# Altium schematic sheet io.SchDoc: SD Cards
size A4; Author: Sorgelig; Revision: 1.1; SheetNumber: 3; SheetTotal: 3
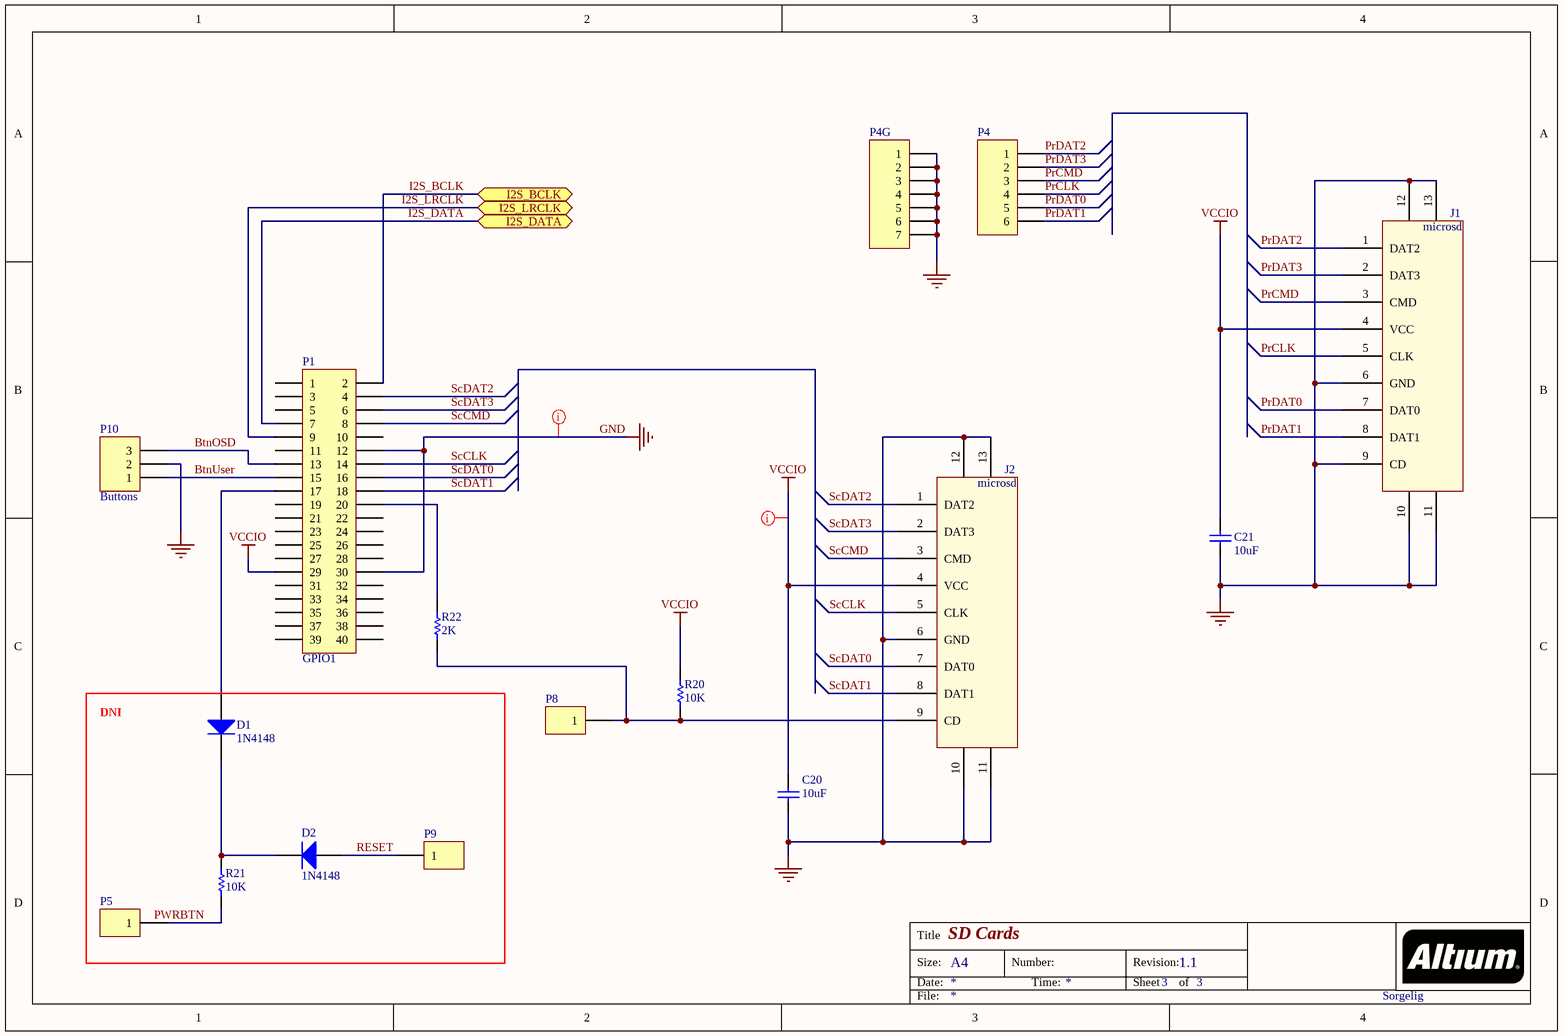
[diagram p0: io.SchDoc]

## Parts
C20  value 10uF  [C0805]  (hidden comment: C0805)
C21  value 10uF  [C0805]  (hidden comment: C0805)
D1  1N4148  [DIODE]
D2  1N4148  [DIODE]
J1  microsd  [microsd]
J2  microsd  [microsd]
P1  GPIO1  [HDR20x2]
P4  Header 6  [HDR1X6]  (value not drawn)
P4G  Header 7  [HDR1X7]  (value not drawn)
P5  Header 1  [Header 1]  (value not drawn)
P8  Header 1  [Header 1]  (value not drawn)
P9  Header 1  [Header 1]  (value not drawn)
P10  Buttons  [HDR1X3]
R20  10K  [R0805]
R21  10K  [R0805]
R22  2K  [R0805]

## Blocks framed on the sheet
DNI: D1 D2 P5 P9 R21

## Ports
I2S_BCLK, I2S_DATA, I2S_LRCLK

## Nets
GND: C20.1 C21.1 J1.6(GND) J1.9(CD) J1.10(GND) J1.11(GND) J1.12(GND) J1.13(GND) J2.6(GND) J2.10(GND) J2.11(GND) J2.12(GND) J2.13(GND) P1.12 P1.30 P4G.1 P4G.2 P4G.3 P4G.4 P4G.5 P4G.6 P4G.7 P10.2
VCCIO: C20.2 C21.2 J1.4(VCC) J2.4(VCC) P1.29 R20.2
BtnOSD: P1.13 P10.3
BtnUser: P1.15 P10.1
I2S_BCLK: P1.2 ; port I2S_BCLK
I2S_DATA: P1.7 ; port I2S_DATA
I2S_LRCLK: P1.9 ; port I2S_LRCLK
PrCLK: J1.5(CLK) P4.4
PrCMD: J1.3(CMD) P4.3
PrDAT0: J1.7(DAT0) P4.5
PrDAT1: J1.8(DAT1) P4.6
PrDAT2: J1.1(DAT2) P4.1
PrDAT3: J1.2(DAT3) P4.2
RESET: D2.1(A) P9.1
ScCLK: J2.5(CLK) P1.14
ScCMD: J2.3(CMD) P1.8
ScDAT0: J2.7(DAT0) P1.16
ScDAT1: J2.8(DAT1) P1.18
ScDAT2: J2.1(DAT2) P1.4
ScDAT3: J2.2(DAT3) P1.6
NetD1_1: D1.1(A) P1.17
NetD1_2: D1.2(K) D2.2(K) R21.1
NetJ2_9: J2.9(CD) P8.1 R20.1 R22.1
NetP1_20: P1.20 R22.2
NetP5_1: P5.1 R21.2

Not connected (* = marked no-connect by the designer): P1 1 3 5 10 11 19 21 22 23 24 25 26 27 28 31 32 33 34 35 36 37 38 39 40

## Layout directives
net class power: GND, VCCIO

## Notes on the sheet
- Sorgelig
- Labels drawn without touching a wire or pin: PWRBTN
- Title
- Size:
- Date:
- A4
- Number:
- Time:
- Revision:
- Sheet
- of
- File:

## Library data of the parts
C20 C21 = C0805: Ceramic Chip Capacitor - Standard; Note: Footprint corresponds to dimensions for bulk cassette packaging. This case size has tightened tolerances.; Published: 17-Jul-2002; LatestRevisionDate: 19-Mar-2004; LatestRevisionNote: Silkscreen size reduced.; DatasheetDocument: Mar-2001; PackageDocument: Mar-2001; PackageReference: 0805; Publisher: Altium Limited; Code_JEITA: 0805; Code_IPC: 2012[0805]; ComponentLink1Description: Manufacturer Link; ComponentLink1URL: http://www.kemet.com/; ComponentLink2Description: Datasheet; ComponentLink2URL: http://www.kemet.com/kemet/web/homepage/kechome.nsf/vapubfilesname/F3102TA.pdf/$file/F3102TA.pdf
D1 D2 = Diode: Default Diode; Published: 8-Jun-2000; LatestRevisionDate: 17-Jul-2002; LatestRevisionNote: Re-released for DXP Platform.; PackageVersion: Sep-1996; PackageReference: SMC; Publisher: Altium Limited; PackageDescription: DO-214-AB/SMC; 2 C-Bend Leads; Body 7.9 x 5.9 mm, inc. leads (LxW); Code_JEDEC: DO-214-AB
P1 = Header 20X2: Header, 20-Pin, Dual row; LatestRevisionDate: 17-Jul-2002; LatestRevisionNote: Re-released for DXP Platform.; Publisher: Altium Limited
P4 = Header 6: Header, 6-Pin; LatestRevisionDate: 17-Jul-2002; LatestRevisionNote: Re-released for DXP Platform.; Publisher: Altium Limited
P4G = Header 7: Header, 7-Pin; LatestRevisionDate: 17-Jul-2002; LatestRevisionNote: Re-released for DXP Platform.; Publisher: Altium Limited
P10 = Header 3: Header, 3-Pin; LatestRevisionDate: 17-Jul-2002; LatestRevisionNote: Re-released for DXP Platform.; Publisher: Altium Limited
R20-R22 = ERJ6RS: Low Ohmic Value Thick Film Chip Resistor, 0.1 Ohm to 0.2 Ohm Range, 1%, 2% and 5% Tolerance, 0805 Size, 0.125 W; Published: 17-Dec-2003; LatestRevisionDate: 19-Mar-2004; LatestRevisionNote: Silkscreen size reduced.; PackageDocument: Mar-2003; PackageReference: 6-0805; Publisher: Altium Limited; Code_IPC: 2012 [0805]; ComponentLink1Description: Manufacturer Link; ComponentLink1URL: http://www.panasonic.com/industrial/components/resistive_products.htm; ComponentLink2Description: Datasheet; ComponentLink2URL: http://www.panasonic.com/industrial/components/pdf/AOA0000CE3.pdf